# Altium schematic sheet cs301_4---------------.SchDoc
size A4; SheetNumber: 1; SheetTotal: 2; SPICEModelCacheRPIWRWHR: <root> / <DocumentId>RPIWRWHR</DocumentId> / </root>
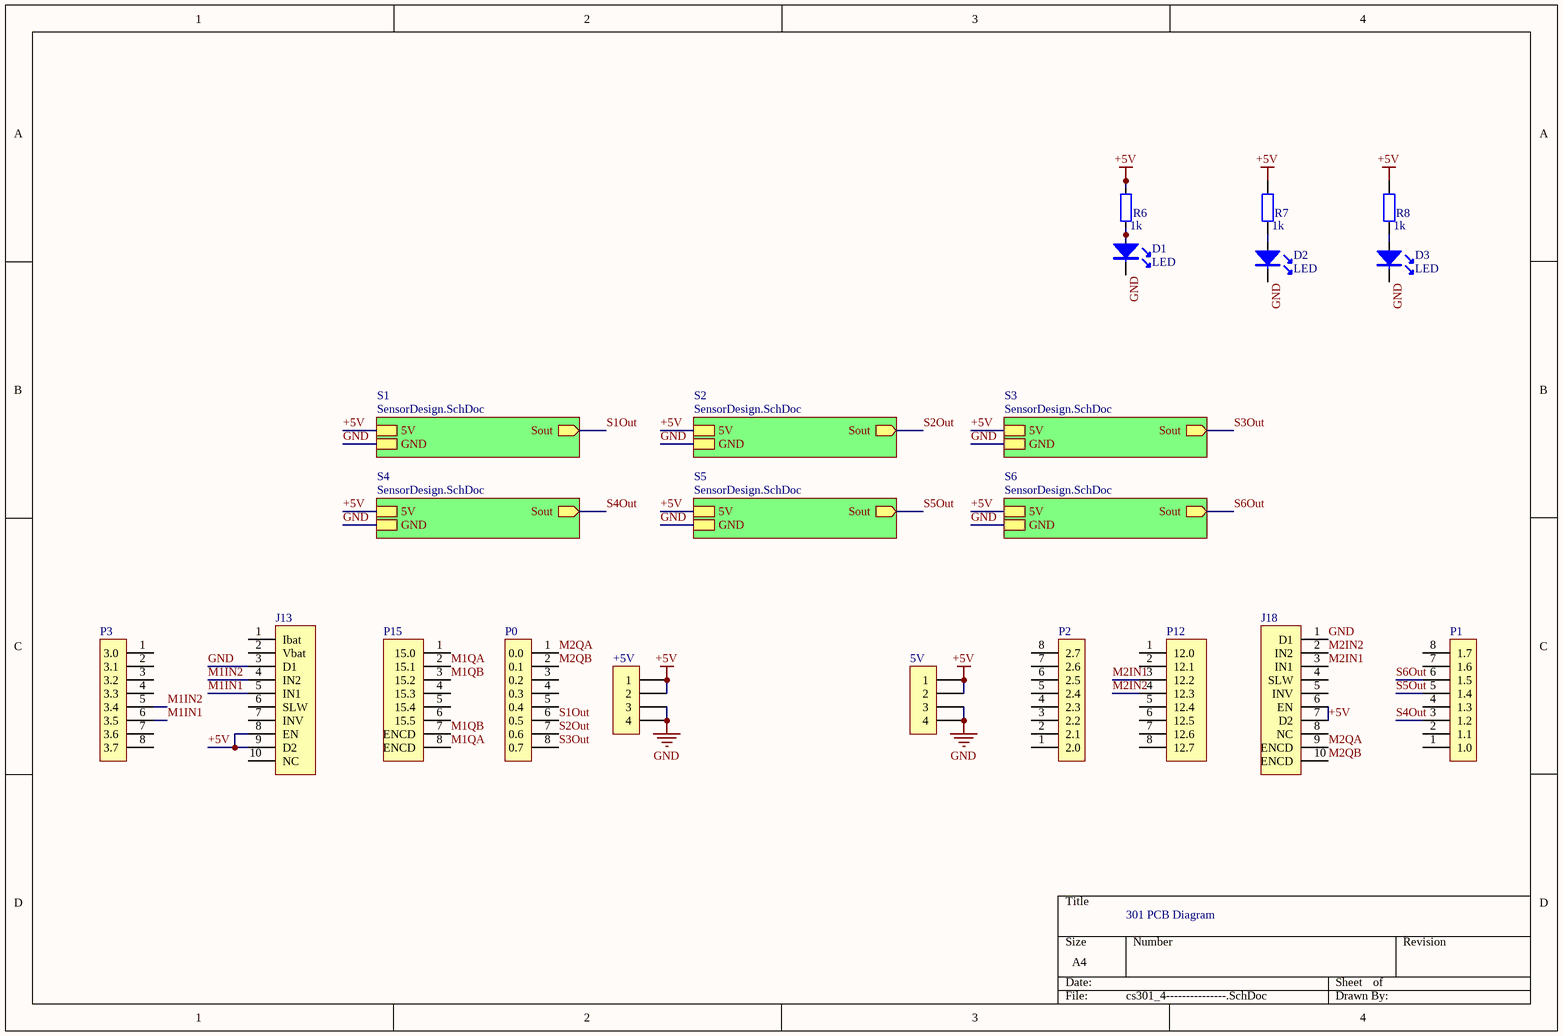
[diagram p0: cs301_4---------------.SchDoc]

## Parts
5V  5V  [IDC4]  (value not drawn)
+5V  5V  [IDC4]  (value not drawn)
D1  LED  [LED0.1/5MM]
D2  LED  [LED0.1/5MM]
D3  LED  [LED0.1/5MM]
J13  CON10  [idc10]  (value not drawn)
J18  CON10  [IDC10]  (value not drawn)
P0  P0  [idc8]  (value not drawn)
P1  P1  [idc8]  (value not drawn)
P2  P2  [idc8]  (value not drawn)
P3  P3  [idc8]  (value not drawn)
P12  P12  [idc8]  (value not drawn)
P15  P15  [idc8]  (value not drawn)
R6  1k  [0805 RES]
R7  1k  [0805 RES]
R8  1k  [0805 RES]

## Sub-sheets
S1 = SensorDesign.SchDoc: 5V, GND, Sout (out)
S2 = SensorDesign.SchDoc: 5V, GND, Sout (out)
S3 = SensorDesign.SchDoc: 5V, GND, Sout (out)
S4 = SensorDesign.SchDoc: 5V, GND, Sout (out)
S5 = SensorDesign.SchDoc: 5V, GND, Sout (out)
S6 = SensorDesign.SchDoc: 5V, GND, Sout (out)

## Nets
+5V: 5V.1 5V.2 +5V.1 +5V.2 J13.8(EN) J13.9(D2) J18.6(EN) J18.7(D2) R6.1 R7.1 R8.1 ; sheet S1/5V, sheet S2/5V, sheet S3/5V, sheet S4/5V, sheet S5/5V, sheet S6/5V
GND: 5V.3 5V.4 +5V.3 +5V.4 D1.K D2.K D3.K J13.3(D1) J18.1(D1) ; sheet S1/GND, sheet S2/GND, sheet S3/GND, sheet S4/GND, sheet S5/GND, sheet S6/GND
M1IN1: J13.5(IN1) P3.6(3.5)
M1IN2: J13.4(IN2) P3.5(3.4)
M1QA: P15.2(15.1) P15.8(ENCD)
M1QB: P15.3(15.2) P15.7(ENCD)
M2IN1: J18.3(IN1) P12.3(12.2)
M2IN2: J18.2(IN2) P12.4(12.3)
M2QA: J18.9(ENCD) P0.1(0.0)
M2QB: J18.10(ENCD) P0.2(0.1)
S1Out: P0.6(0.5) ; sheet S1/Sout
S2Out: P0.7(0.6) ; sheet S2/Sout
S3Out: P0.8(0.7) ; sheet S3/Sout
S4Out: P1.3(1.2) ; sheet S4/Sout
S5Out: P1.5(1.4) ; sheet S5/Sout
S6Out: P1.6(1.5) ; sheet S6/Sout
NetD1_A: D1.A R6.2
NetD2_A: D2.A R7.2
NetD3_A: D3.A R8.2

Not connected (* = marked no-connect by the designer): J13 1(Ibat) 2(Vbat) 6(SLW) 7(INV) 10(NC); J18 4(SLW) 5(INV) 8(NC); P0 3(0.2) 4(0.3) 5(0.4); P1 1(1.0) 2(1.1) 4(1.3) 7(1.6) 8(1.7); P2 1(2.0) 2(2.1) 3(2.2) 4(2.3) 5(2.4) 6(2.5) 7(2.6) 8(2.7); P3 1(3.0) 2(3.1) 3(3.2) 4(3.3) 7(3.6) 8(3.7); P12 1(12.0) 2(12.1) 5(12.4) 6(12.5) 7(12.6) 8(12.7); P15 1(15.0) 4(15.3) 5(15.4) 6(15.5)

## Notes on the sheet
- 301 PCB Diagram

## Library data of the parts
5V +5V = CON4: Connector
J13 J18 = CON10: Connector
P0-P3 = CON8: Connector
P12 P15 = CON8_1: Connector
R6-R8 = Res_SMT_0805: 0805 resistor; Value: 1k; Published: 8-Jun-2000; LatestRevisionDate: 17-Jul-2002; LatestRevisionNote: Re-released for DXP Platform.; PackageReference: AXIAL-0.4; Publisher: Altium Limited; ComponentLink1Description: https://nz.mouser.com/datasheet/2/315/AOA0000C304-1149620.pdf